# Altium schematic sheet opg_receiver_schematics.SchDoc
size A4; SheetNumber: 1; SheetTotal: 1
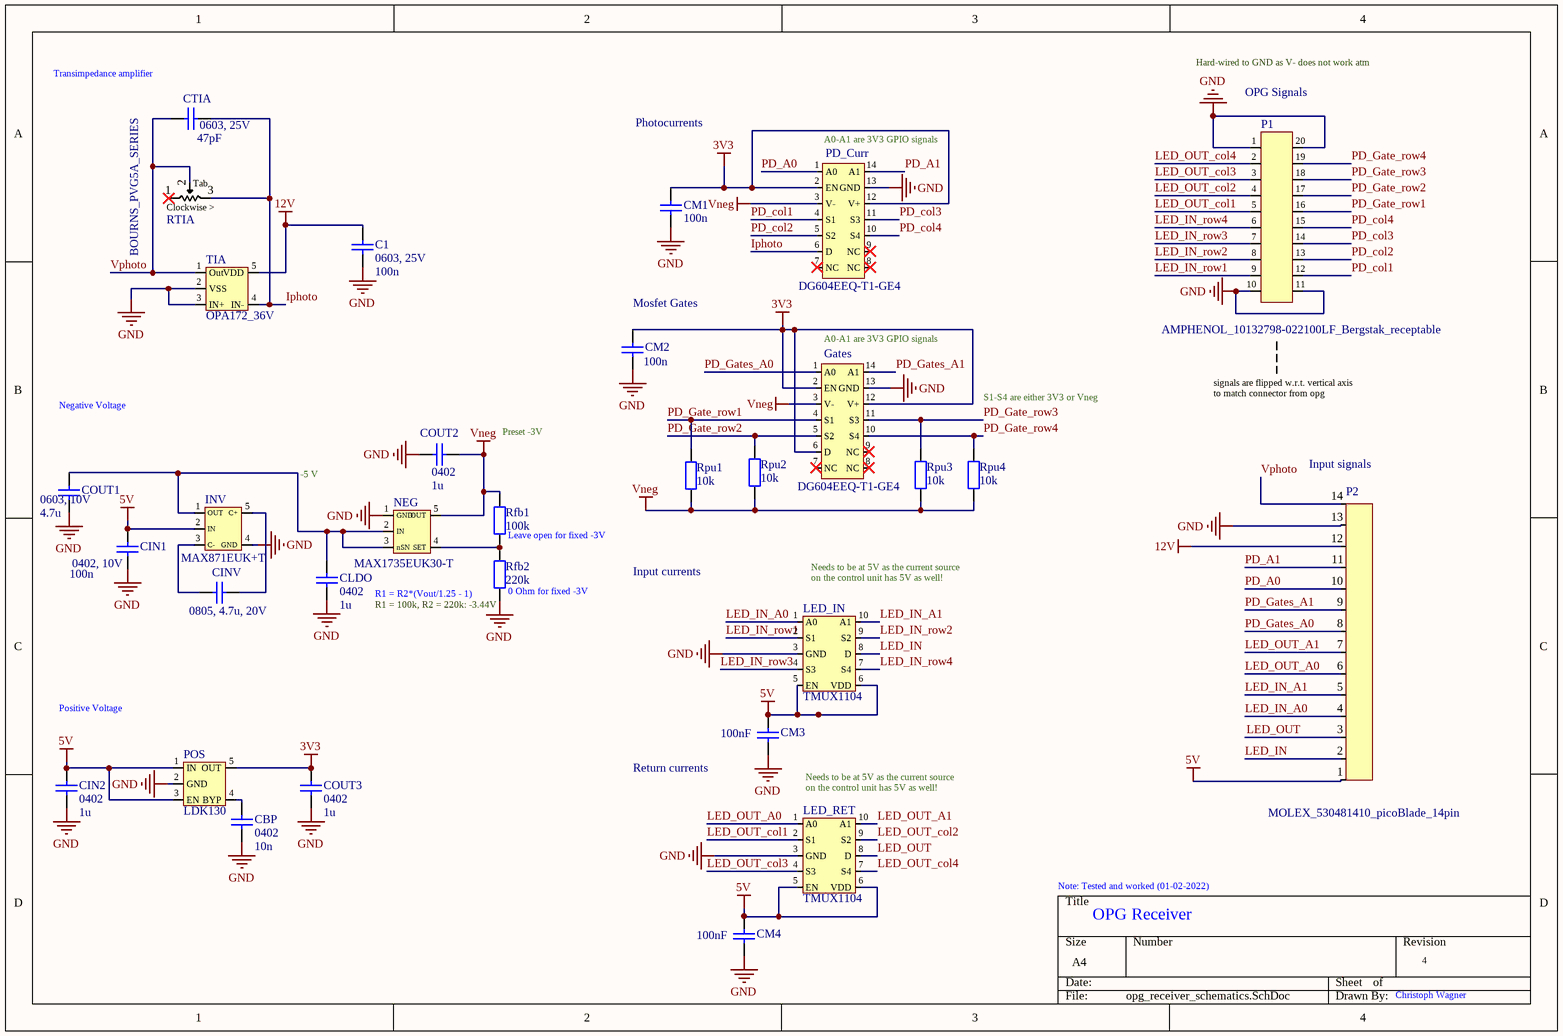
[diagram p0: opg_receiver_schematics.SchDoc]

## Parts
C1  0603, 25V  value 100n  [1608[0603]]
CBP  0402  value 10n  [0402]
CIN1  0402, 10V  value 100n  [1608[0603]]
CIN2  0402  value 1u  [0402]
CINV  0805, 4.7u, 20V  [WCAP-CSGP_0805_H=0.8mm_Reflow]
CLDO  0402  value 1u  [0402]
CM1  value 100n  [0402]
CM2  value 100n  [0402]
CM3  value 100nF  [0402]
CM4  value 100nF  [0402]
COUT1  0603, 10V  value 4.7u  [1608[0603]]
COUT2  0402  value 1u  [0402]
COUT3  0402  value 1u  [0402]
CTIA  0603, 25V  value 47pF  [1608[0603]]
Gates  DG604EEQ-T1-GE4  [DG604EEQ-T1-GE4]
INV  MAX871EUK+T  [MAX871EUK+T]
LED_IN  TMUX1104  [TMUX1104_legged]
LED_RET  TMUX1104  [TMUX1104_legged]
NEG  MAX1735EUK30-T  [MAX1735EUKxx-T]
P1  AMPHENOL_10132798-022100LF_Bergstak_receptable  [AMPHENOL_10132798-022100LF_Bergstak_receptable]
P2  MOLEX_530481410_picoBlade_14pin  [MOLEX_530481410_picoBlade_14pin]
PD_Curr  DG604EEQ-T1-GE4  [DG604EEQ-T1-GE4]
POS  LDK130  [LDK130]
Rfb1  100k  [WRIS-KSKE_0805]
Rfb2  220k  [WRIS-KSKE_0805]
Rpu1  10k  [WRIS-KSKE_0402]
Rpu2  10k  [WRIS-KSKE_0402]
Rpu3  10k  [WRIS-KSKE_0402]
Rpu4  10k  [WRIS-KSKE_0402]
RTIA  BOURNS_PVG5A_SERIES  [BOURNS_PVG5A_SERIES]
TIA  OPA172_36V  [OPA172_36V_SC70-5]

## Nets
3V3: CM1.2 CM2.2 COUT3.2 Gates.2(EN) Gates.6(D) Gates.12(V+) PD_Curr.2(EN) PD_Curr.12(V+) POS.5(OUT)
5V: CIN1.2 CIN2.1 CM3.1 CM4.2 INV.2(IN) LED_IN.5(EN) LED_IN.6(VDD) LED_RET.5(EN) LED_RET.6(VDD) P2.1 POS.1(IN) POS.3(EN)
12V: C1.2 P2.12 TIA.5(VDD)
GND: C1.1 CBP.2 CIN1.1 CIN2.2 CLDO.2 CM1.1 CM2.1 CM3.2 CM4.1 COUT1.2 COUT2.1 COUT3.1 Gates.13(GND) INV.4(GND) LED_IN.3(GND) LED_RET.3(GND) NEG.1(GND) P1.1 P1.10 P1.11 P1.20 P2.13 PD_Curr.13(GND) POS.2(GND) Rfb2.2 TIA.2(VSS) TIA.3(IN+)
Vneg: COUT2.2 Gates.3(V-) NEG.5(OUT) PD_Curr.3(V-) Rfb1.1 Rpu1.1 Rpu2.1 Rpu3.1 Rpu4.1
Iphoto: CTIA.1 PD_Curr.6(D) RTIA.3 TIA.4(IN-)
LED_IN: LED_IN.8(D) P2.2
LED_IN_A0: LED_IN.1(A0) P2.4
LED_IN_A1: LED_IN.10(A1) P2.5
LED_IN_row1: LED_IN.2(S1) P1.9
LED_IN_row2: LED_IN.9(S2) P1.8
LED_IN_row3: LED_IN.4(S3) P1.7
LED_IN_row4: LED_IN.7(S4) P1.6
LED_OUT: LED_RET.8(D) P2.3
LED_OUT_A0: LED_RET.1(A0) P2.6
LED_OUT_A1: LED_RET.10(A1) P2.7
LED_OUT_col1: LED_RET.2(S1) P1.5
LED_OUT_col2: LED_RET.9(S2) P1.4
LED_OUT_col3: LED_RET.4(S3) P1.3
LED_OUT_col4: LED_RET.7(S4) P1.2
PD_A0: P2.10 PD_Curr.1(A0)
PD_A1: P2.11 PD_Curr.14(A1)
PD_col1: P1.12 PD_Curr.4(S1)
PD_col2: P1.13 PD_Curr.5(S2)
PD_col3: P1.14 PD_Curr.11(S3)
PD_col4: P1.15 PD_Curr.10(S4)
PD_Gate_row1: Gates.4(S1) P1.16 Rpu1.2
PD_Gate_row2: Gates.5(S2) P1.17 Rpu2.2
PD_Gate_row3: Gates.11(S3) P1.18 Rpu3.2
PD_Gate_row4: Gates.10(S4) P1.19 Rpu4.2
PD_Gates_A0: Gates.1(A0) P2.8
PD_Gates_A1: Gates.14(A1) P2.9
Vphoto: CTIA.2 P2.14 RTIA.2 TIA.1(Out)
NetCBP_1: CBP.1 POS.4(BYP)
NetCINV_1: CINV.1 INV.3(C-)
NetCINV_2: CINV.2 INV.5(C+)
NetCLDO_1: CLDO.1 COUT1.1 INV.1(OUT) NEG.2(IN) NEG.3(nSN)
NetNEG_4: NEG.4(SET) Rfb1.2 Rfb2.1

Not connected (* = marked no-connect by the designer): Gates 7(NC)* 8(NC)* 9(NC)*; PD_Curr 7(NC)* 8(NC)* 9(NC)*; RTIA 1*

## Notes on the sheet
- (near CTIA) Transimpedance amplifier
- Hard-wired to GND as V- does not work atm
- (near P1) OPG Signals
- Photocurrents
- (near PD_Curr) A0-A1 are 3V3 GPIO signals
- (near CM2) Mosfet Gates
- (near Gates) A0-A1 are 3V3 GPIO signals
- signals are flipped w.r.t. vertical axis
- Negative Voltage
- Preset -3V
- S1-S4 are either 3V3 or Vneg
- to match connector from opg
- -5 V
- (near P2) Input signals
- (near Rfb1) Leave open for fixed -3V
- Input currents
- Needs to be at 5V as the current source
- (near LED_IN) on the control unit has 5V as well!
- (near Rfb2) R1 = R2*(Vout/1.25 - 1)
- (near Rfb2) R1 = 100k, R2 = 220k: -3.44V
- (near Rfb2) 0 Ohm for fixed -3V
- Positive Voltage
- (near CM3) Return currents
- (near LED_RET) on the control unit has 5V as well!
- Note: Tested and worked (01-02-2022)
- OPG Receiver
- 4
- Christoph Wagner
- (in symbol BOURNS_PVG5A_SERIES) Tab; Clockwise >

## Library data of the parts
C1 CBP CIN1 CIN2 CLDO CM1-CM4 COUT1-COUT3 CTIA = Cap Semi: Capacitor (Semiconductor SIM Model); Published: 8-Jun-2000; LatestRevisionDate: 29-May-2009; LatestRevisionNote: IPC-7351 Footprint Added.; PackageReference: C1206; Publisher: Altium Limited; PackageDescription: Chip Capacitor
CINV = 885012207032: WCAP-CSGP Multilayer Ceramic Chip Capacitor, General Purpose, size 0805, X7R, 680pF, 16V; Manufacturer: Wurth Elektronik; Rated Voltage: 16VDC; Isolation Resistance  min.: 10GOhm; Capacitance Tolerance: +/-10%; Dissipation Factor max.: 3.5%; Technical Reference: X7R0805681K016DFCT10000; ComponentLink1Description: Manufacturer; ComponentLink1URL: http://www.we-online.de; ComponentLink2Description: Datasheet; ComponentLink2URL: https://www.we-online.com/catalog/datasheet/885012207032.pdf; Operating Temperature: -55 to +125degC; Packaging: Tape and Reel; Manufacturer Part Number: 885012207032; Published Date: April 2021; Ceramic Type: X7R; Height: 0.8mm; Mounting Technology: SMT; Size: 0805; Capacitance: 680pF; Q-Factor min.: -
Gates PD_Curr = DG604EEQ-T1-GE4: Multiplex-Schalter IC CMOS 4:1 Multiplxr 14-pin TSSOP
INV = MAX871EUK+T: 500 kHz Switched-Capacitor Voltage Inverters
LED_IN LED_RET = TMUX1104: 4:1 MUX
NEG = MAX1735EUKxx-T
P1 = AMPHENOL_10132798-022100LF_Bergstak_receptable: 20 pin, 0.5 mm pitch, 3 mm mated height, female/receptable
POS = LDK130: 300 mA low quiescent current very low noise LDO
Rfb1 Rfb2 = 560050320011: WRIS-KSKE SMT Thick Film Resistor, size 0805, 1Ohm, 0.33W; Manufacturer: Wurth Elektronik; Rated Current: 0.57A; Temperature Coefficient of Resistance: +/-100ppm/degC; Technical Reference: KE08051R00F103KAATP0000; Resistance Tolerance: +/-1%; ComponentLink1Description: Manufacturer; ComponentLink1URL: http://www.we-online.de; ComponentLink2Description: Datasheet; ComponentLink2URL: https://www.we-online.com/catalog/datasheet/560050320011.pdf; Published Date: May 2020; Rated Power: 0.33W; Resistance: 1Ohm; Height: 0.6mm; Operating Temperature: -55 to +155degC; Mounting Technology: SMT; Packaging: Tape and Reel; Size: 0805; Length: 2mm; Manufacturer Part Number: 560050320011; Width: 1.25mm
Rpu1-Rpu4 = 560050310009: WRIS-KSKE SMT Thick Film Resistor, size 0402, 10Ohm, 0.125W; Manufacturer: Wurth Elektronik; Rated Current: 0.11A; Temperature Coefficient of Resistance: +/-100ppm/degC; Technical Reference: KE04020100F108KAATH0000; Resistance Tolerance: +/-1%; ComponentLink1Description: Manufacturer; ComponentLink1URL: http://www.we-online.de; ComponentLink2Description: Datasheet; ComponentLink2URL: https://www.we-online.com/catalog/datasheet/560050310009.pdf; Published Date: May 2020; Rated Power: 0.125W; Resistance: 10Ohm; Height: 0.35mm; Operating Temperature: -55 to +155degC; Mounting Technology: SMT; Packaging: Tape and Reel; Size: 0402; Length: 1mm; Manufacturer Part Number: 560050310009; Width: 0.5mm
TIA = OPA172_36V: OPAx172 36-V, Single-Supply, 10-MHz, Rail-to-Rail Output Operational Amplifiers; pin to pad: 1>4 3>1 4>3